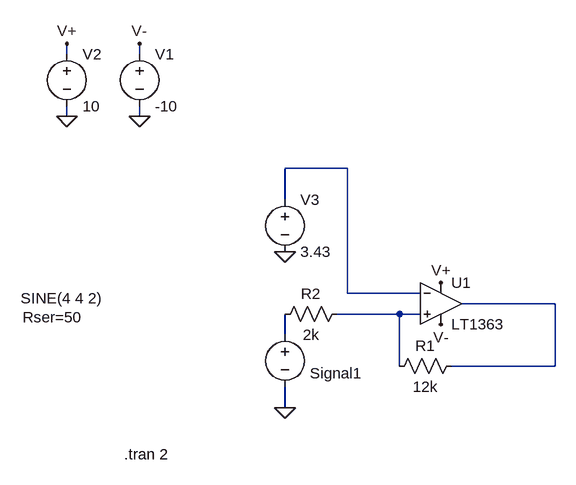
[diagram p0: schematic schmidt_trigger.asc]
schmidt_trigger.asc, the LTspice schematic file:
Version 4
SHEET 1 880 680
WIRE -656 -496 -656 -512
WIRE -544 -496 -544 -512
WIRE -656 -400 -656 -416
WIRE -544 -400 -544 -416
WIRE -224 -320 -320 -320
WIRE -320 -272 -320 -320
WIRE -224 -128 -224 -320
WIRE -112 -128 -224 -128
WIRE 96 -112 -48 -112
WIRE -144 -96 -240 -96
WIRE -112 -96 -144 -96
WIRE -320 -64 -320 -96
WIRE -144 -16 -144 -96
WIRE 96 -16 96 -112
WIRE 96 -16 -64 -16
WIRE -320 48 -320 16
FLAG -320 48 0
FLAG -544 -400 0
FLAG -656 -400 0
FLAG -656 -512 V+
FLAG -544 -512 V-
FLAG -80 -144 V+
FLAG -80 -80 V-
FLAG -320 -192 0
SYMBOL voltage -320 -80 R0
WINDOW 3 -407 -40 Left 2
WINDOW 123 0 0 Left 2
WINDOW 39 -404 -11 Left 2
WINDOW 0 38 75 Left 2
SYMATTR Value SINE(4 4 2)
SYMATTR SpiceLine Rser=50
SYMATTR InstName Signal1
SYMBOL voltage -544 -512 R0
WINDOW 123 0 0 Left 2
WINDOW 39 0 0 Left 2
SYMATTR InstName V1
SYMATTR Value -10
SYMBOL voltage -656 -512 R0
WINDOW 123 0 0 Left 2
WINDOW 39 0 0 Left 2
SYMATTR InstName V2
SYMATTR Value 10
SYMBOL Opamps\\LT1363 -80 -176 R0
SYMATTR InstName U1
SYMBOL res -48 -32 R90
WINDOW 0 0 56 VBottom 2
WINDOW 3 32 56 VTop 2
SYMATTR InstName R1
SYMATTR Value 12k
SYMBOL res -224 -112 R90
WINDOW 0 0 56 VBottom 2
WINDOW 3 32 56 VTop 2
SYMATTR InstName R2
SYMATTR Value 2k
SYMBOL voltage -320 -288 R0
WINDOW 123 0 0 Left 2
WINDOW 39 0 0 Left 2
SYMATTR InstName V3
SYMATTR Value 3.43
TEXT -568 120 Left 2 !.tran 2

The netlist it stands for:
* schmidt_trigger.asc
V§Signal1 N004 0 SINE(4 4 2) Rser=50
V1 V- 0 -10
V2 V+ 0 10
XU1 N003 N001 V+ V- N002 LT1363  ; pins In+ In- V+ V- OUT
R1 N002 N003 12k
R2 N003 N004 2k
V3 N001 0 3.43
.tran 2
.lib LT1363.sub
.backanno
.end